# EAGLE schematic RDA5807FP_SETUP (EAGLE 9.6.2)
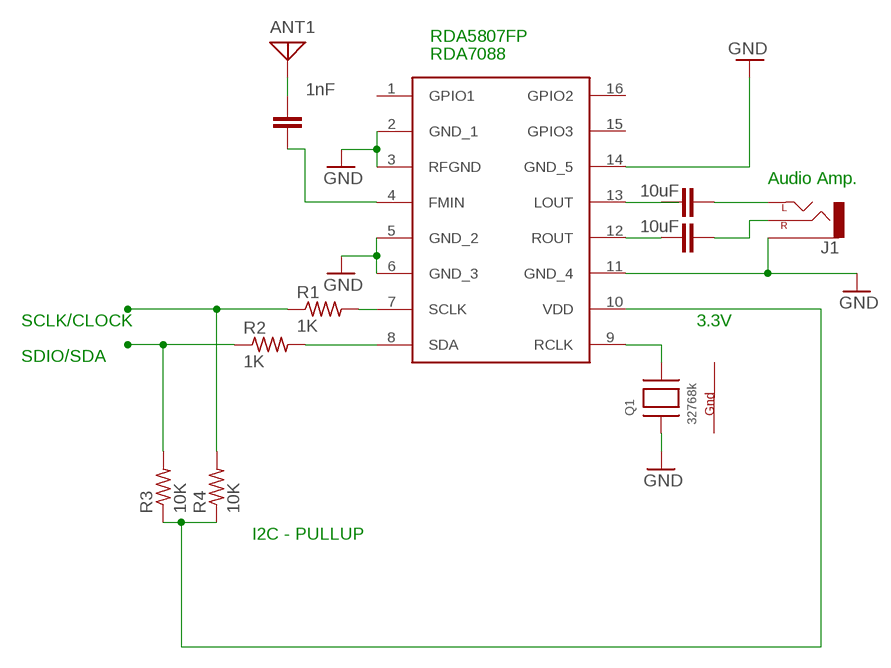
[diagram p0: schematic, sheet 1]
C1 (C): C: 1nF
C2 (C): C: 10uF
C3 (C): C: 10uF

## Parts
ANT1  ANTENNA  [PAD-01]
J1  AUDIO_JACK_2.5MMSPECIAL_POGO_PINS  [STEREOJACK2.5MM_SPECIAL_POGOPINS]
Q1  32768k  XTAL-4-3225  [NX3225]
R1  1K  R-US_0204/2V  [0204V]
R2  1K  R-US_0204/2V  [0204V]
R3  10K  R-US_0204/2V  [0204V]
R4  10K  R-US_0204/2V  [0204V]
U$1  RDA5807FPRDA5807FP  [RDA5807FP]

## Nets
GND: J1.RING1(SLEEVE) Q1.1(X1) U$1.2(GND_1) U$1.3(RFGND) U$1.5(GND_2) U$1.6(GND_3) U$1.11(GND_4) U$1.14(GND_5)
N$1: R1.2 U$1.7(SCLK)
N$2: R2.2 U$1.8(SDA)
N$3: U$1.13(LOUT)
N$4: R1.1 R4.2
N$5: R2.1 R3.2
N$7: U$1.12(ROUT)
N$8: J1.SHIELD(LEFT)
N$9: ANT1.1
N$10: R3.1 R4.1 U$1.10(VDD)
N$11: U$1.4(FMIN)
N$12: J1.TIP(RIGHT)
N$13: Q1.3(X2) U$1.9(RCLK)
Unconnected: U$1.1(GPIO1) U$1.15(GPIO3) U$1.16(GPIO2)

## Notes on the sheet
- RDA5807FP
- RDA7088
- Audio Amp.
- SCLK/CLOCK | 3.3V
- SDIO/SDA
- I2C - PULLUP

## Power pins joined to a net without a drawn wire
G1: Q1.4(G1)
G2: Q1.2(G2)

## Library data of the parts
ANT1 = discrete:ANTENNA: Antenna
J1 = SparkFun-Connectors:AUDIO_JACK_2.5MM: Audio Jack 2.5mm variants of PTH and SMT audio jacks. SparkFun Products: SparkFun PicoBoard <https://www.sparkfun.com/products/11888>- 2.5mm SMD
Q1 = adafruit:XTAL-4: Classic 4-pin 3.2 x 2.5mm crystal
R1-R4 = adafruit:R-US_: RESISTOR, American symbol
U$1 = RDA5807FP:RDA5807FP